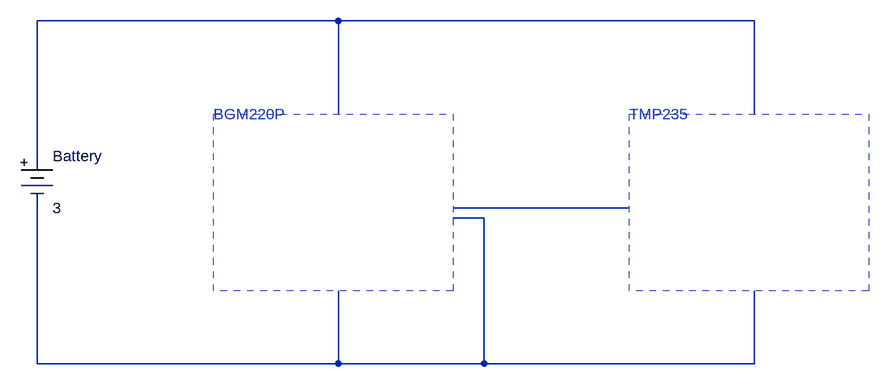
[diagram p0: schematic TPMS model.asc]
TPMS model.asc, the LTspice schematic file:
Version 4.1
SHEET 1 1364 680
WIRE 544 -80 80 -80
WIRE 1184 -80 544 -80
WIRE 544 64 544 -80
WIRE 1184 64 1184 -80
WIRE 80 128 80 -80
WIRE 992 208 720 208
WIRE 768 224 720 224
WIRE 80 448 80 208
WIRE 544 448 544 336
WIRE 544 448 80 448
WIRE 768 448 768 224
WIRE 768 448 544 448
WIRE 1184 448 1184 336
WIRE 1184 448 768 448
SYMBOL Misc\\battery 80 112 R0
WINDOW 123 0 0 Left 0
WINDOW 39 0 0 Left 0
SYMATTR InstName Battery
SYMATTR Value 3
TEXT 352 64 Left 2 ;BGM220P
TEXT 992 64 Left 2 ;TMP235
RECTANGLE Normal 720 336 352 64 2
RECTANGLE Normal 1360 336 992 64 2

The netlist it stands for:
* TPMS model.asc
V§Battery N001 N003 3
* BGM220P
* TMP235
.backanno
.end